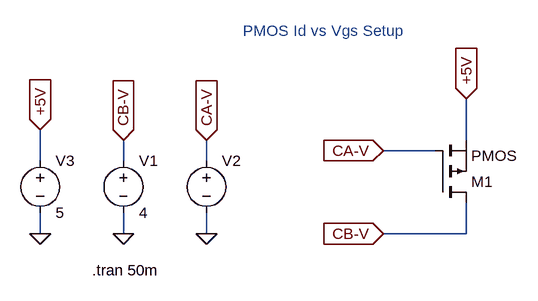
[diagram p0: schematic pmos_id_vs_vgs_ltspice.asc]
pmos_id_vs_vgs_ltspice.asc, the LTspice schematic file:
Version 4
SHEET 1 880 680
WIRE 176 112 176 48
WIRE 128 128 48 128
WIRE -480 144 -480 96
WIRE -352 144 -352 112
WIRE -224 144 -224 112
WIRE -480 256 -480 224
WIRE -352 256 -352 224
WIRE -224 256 -224 224
WIRE 176 256 176 208
WIRE 176 256 48 256
FLAG 48 256 CB-V
IOPIN 48 256 In
FLAG 48 128 CA-V
IOPIN 48 128 In
FLAG -352 256 0
FLAG -224 256 0
FLAG -352 112 CB-V
IOPIN -352 112 In
FLAG -224 112 CA-V
IOPIN -224 112 In
FLAG 176 48 +5V
IOPIN 176 48 In
FLAG -480 256 0
FLAG -480 96 +5V
IOPIN -480 96 In
SYMBOL voltage -352 128 R0
WINDOW 123 0 0 Left 0
WINDOW 39 0 0 Left 0
SYMATTR InstName V1
SYMATTR Value 4
SYMBOL voltage -224 128 R0
WINDOW 3 24 96 Invisible 2
SYMATTR Value PWL REPEAT FOREVER(0 2.75 2.5m 4.5 5m 2.75 7.5m 1 10m 2.75) ENDREPEAT
SYMATTR InstName V2
SYMBOL pmos 128 208 M180
SYMATTR InstName M1
SYMBOL voltage -480 128 R0
WINDOW 123 0 0 Left 0
WINDOW 39 0 0 Left 0
SYMATTR InstName V3
SYMATTR Value 5
TEXT -168 -56 Left 2 ;PMOS Id vs Vgs Setup
TEXT -400 312 Left 2 !.tran 50m

The netlist it stands for:
* pmos_id_vs_vgs_ltspice.asc
V1 CB-V 0 4
V2 CA-V 0 PWL REPEAT FOREVER(0 2.75 2.5m 4.5 5m 2.75 7.5m 1 10m 2.75) ENDREPEAT
M1 CB-V CA-V +5V +5V PMOS
V3 +5V 0 5
.model NMOS NMOS
.model PMOS PMOS
.lib standard.mos
* PMOS Id vs Vgs Setup
.tran 50m
.backanno
.end